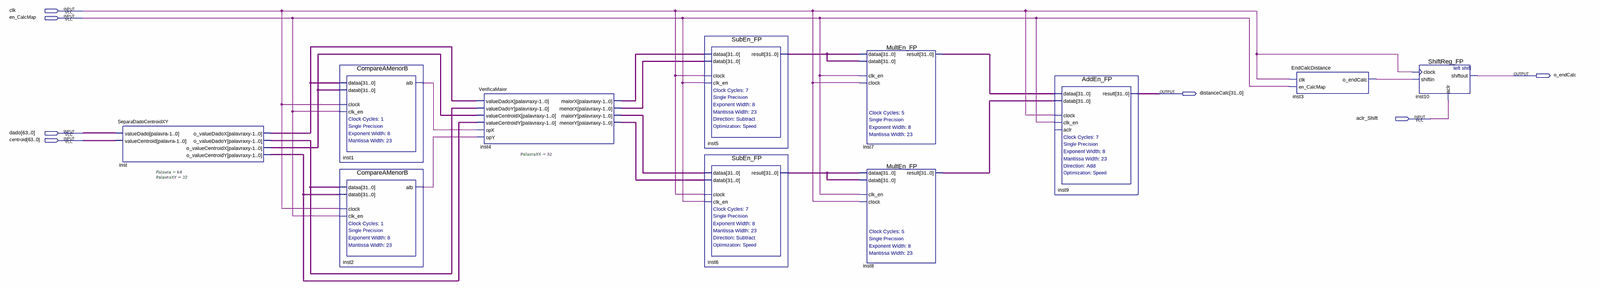
[diagram p0: schematic sheet, whole]
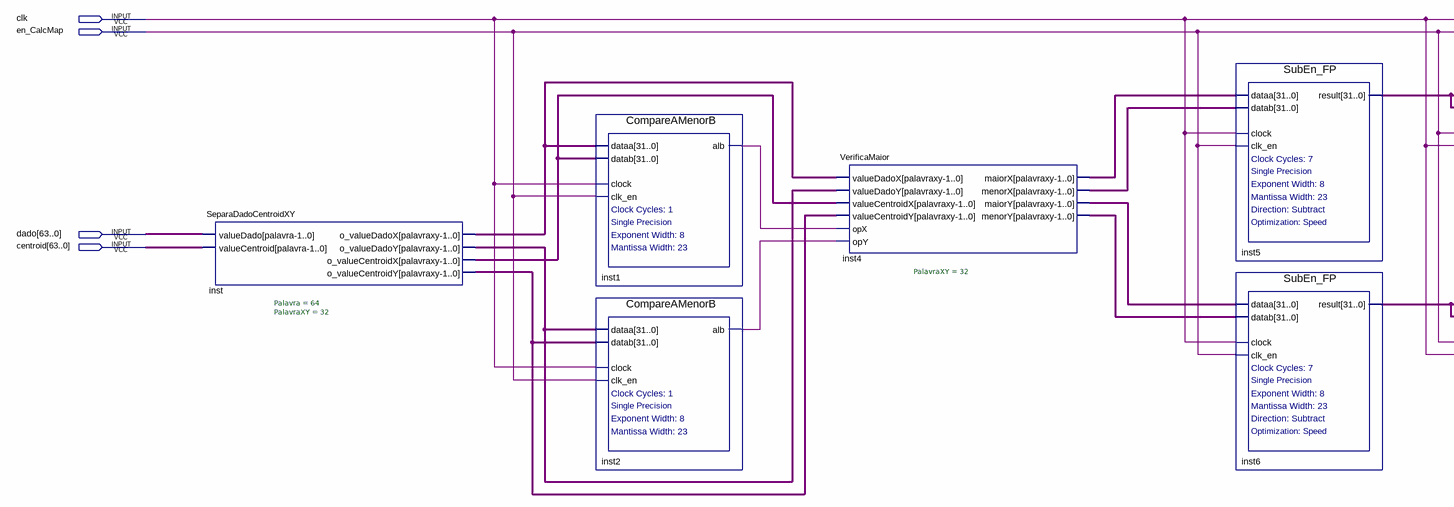
[diagram p1: schematic sheet, left part]
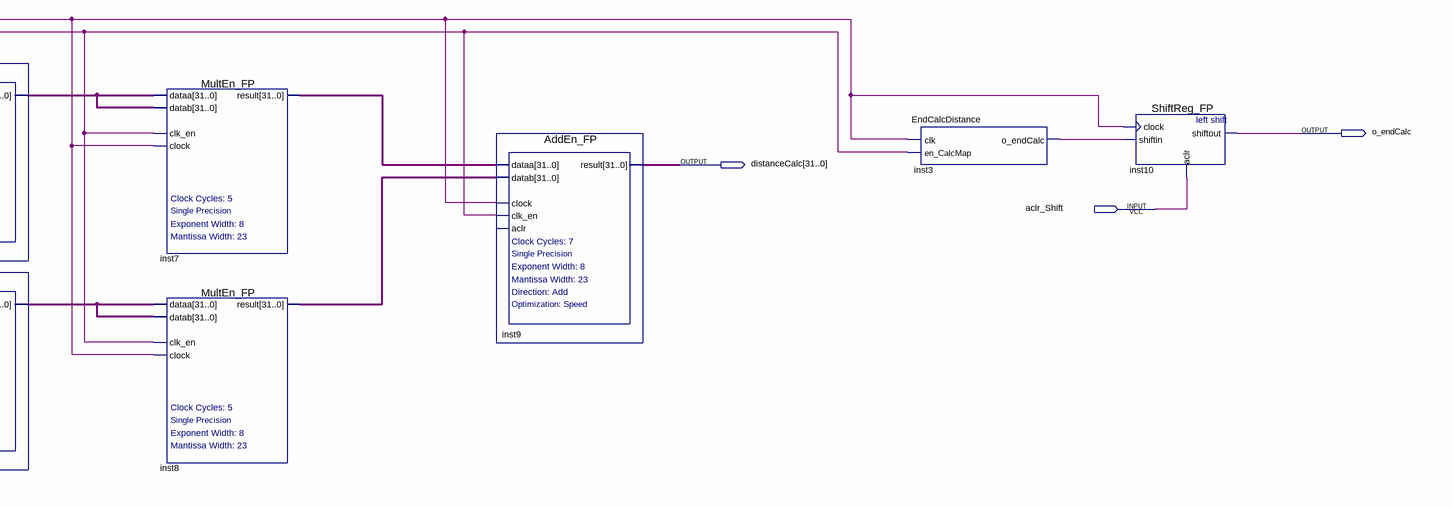
[diagram p2: schematic sheet, right part]
// Quartus schematic CalcMap.bdf as structural Verilog: 11 symbols, 7 pins
module CalcMap (
  input  clk,
  input  en_CalcMap,
  input  aclr_Shift,
  input  [63:0] dado,
  input  [63:0] centroid,
  output o_endCalc,
  output [31:0] distanceCalc
);

  wire inst1_alb, inst2_alb, inst3_o_endcalc;
  wire [31:0] inst4_maiorx, inst4_maiory, inst4_menorx, inst4_menory, inst5_result, inst6_result,
       inst7_result, inst8_result, inst_o_valuecentroidx, inst_o_valuecentroidy, inst_o_valuedadox,
       inst_o_valuedadoy;

  SeparaDadoCentroidXY #(.Palavra(64), .PalavraXY(32)) inst (
    .valueDado(dado), .valueCentroid(centroid), .o_valueDadoX(inst_o_valuedadox),
    .o_valueDadoY(inst_o_valuedadoy), .o_valueCentroidX(inst_o_valuecentroidx),
    .o_valueCentroidY(inst_o_valuecentroidy));
  CompareAMenorB inst1 (
    .dataa(inst_o_valuedadox), .datab(inst_o_valuecentroidx), .clock(clk), .clk_en(en_CalcMap),
    .alb(inst1_alb));
  CompareAMenorB inst2 (
    .dataa(inst_o_valuedadoy), .datab(inst_o_valuecentroidy), .clock(clk), .clk_en(en_CalcMap),
    .alb(inst2_alb));
  VerificaMaior #(.PalavraXY(32)) inst4 (
    .valueDadoX(inst_o_valuedadox), .valueDadoY(inst_o_valuedadoy), .valueCentroidX(inst_o_valuecentroidx),
    .valueCentroidY(inst_o_valuecentroidy), .opX(inst1_alb), .opY(inst2_alb), .maiorX(inst4_maiorx),
    .menorX(inst4_menorx), .maiorY(inst4_maiory), .menorY(inst4_menory));
  SubEn_FP inst5 (.dataa(inst4_maiorx), .datab(inst4_menorx), .clock(clk), .clk_en(en_CalcMap), .result(inst5_result));
  SubEn_FP inst6 (.dataa(inst4_maiory), .datab(inst4_menory), .clock(clk), .clk_en(en_CalcMap), .result(inst6_result));
  MultEn_FP inst7 (.dataa(inst5_result), .datab(inst5_result), .clk_en(en_CalcMap), .clock(clk), .result(inst7_result));
  MultEn_FP inst8 (.dataa(inst6_result), .datab(inst6_result), .clk_en(en_CalcMap), .clock(clk), .result(inst8_result));
  AddEn_FP inst9 (
    .dataa(inst7_result), .datab(inst8_result), .clock(clk), .clk_en(en_CalcMap), .result(distanceCalc));  // open: aclr
  EndCalcDistance inst3 (.clk(clk), .en_CalcMap(en_CalcMap), .o_endCalc(inst3_o_endcalc));
  ShiftReg_FP inst10 (.clock(clk), .shiftin(inst3_o_endcalc), .aclr(aclr_Shift), .shiftout(o_endCalc));
endmodule
